# EasyEDA schematic SCH_espweather_2025-04-03.json
TITLE: espweather; REV: 1.0; Date: 2024-01-15; Sheet: 1/1; Drawn By: gitaroktato; Company: gitaroktato
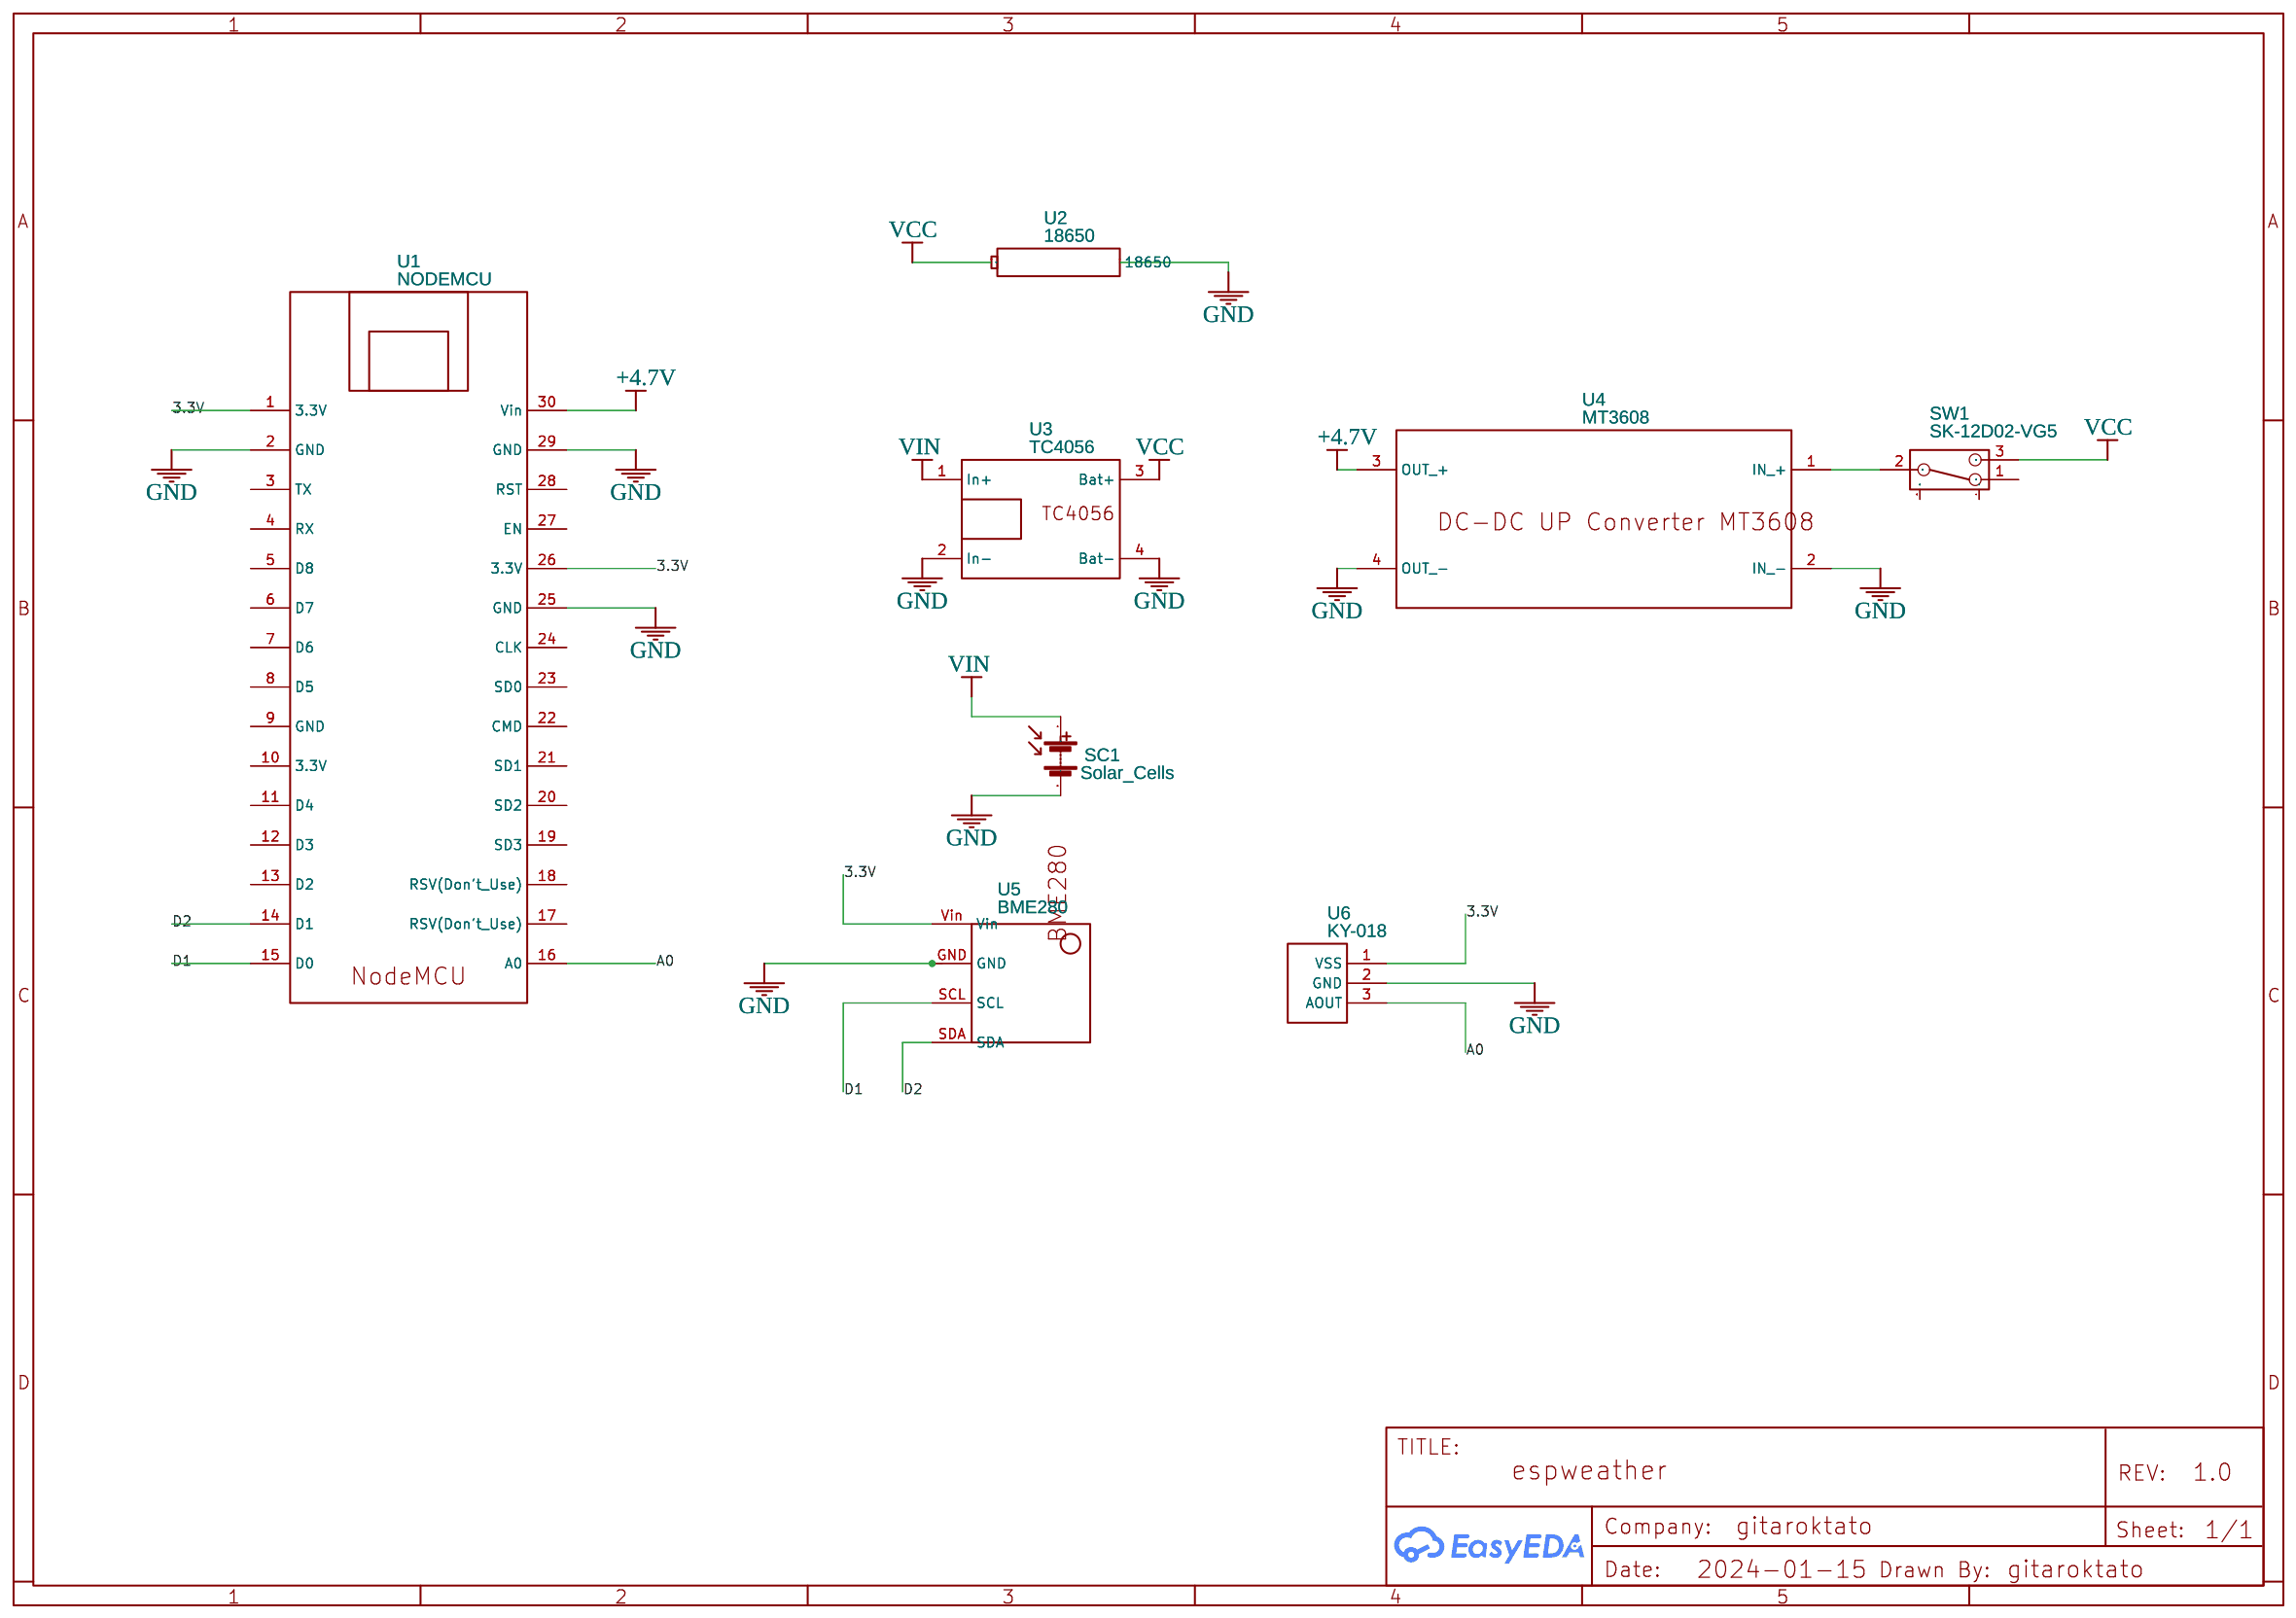
[diagram p0: schematic sheet]

## Parts
SC1  Solar_Cells
SW1  SK-12D02-VG5  [SW-TH_SK-12D02VG3]
U1  NODEMCU  [ESP12E_DEVKIT-V1]
U2  18650
U3  TC4056  [BATTERY CHARGER COPY]
U4  MT3608  [MT3608-ROUND Z]
U5  BME280  [BME280]
U6  KY-018

## Library data of the parts
SC1 = Solar_Cells: Contributor: KiCAD; license: https://www.gnu.org/licenses/lgpl-2.1.html
SW1 = SK-12D02-VG5: Supplier: LCSC; Supplier Part: C136722; Manufacturer: Rectangular Connectors - Contacts; Contributor: LCSC
U1 = NODEMCU: Contributor: canda410; sourceId: OGtr1ZXUS
U2 = 18650_2: catid: 20; Contributor: ashysb2115; sim: true
U3 = LIPO CHARGER FC-75 PCCN: Manufacturer Part: Lipo Charger FC-75; Contributor: paiboonp
U4 = MT3608: Contributor: beloborodov.arty
U5 = BME280 COPY: Contributor: Carlosjz
U6 = KY-018 Arduino Module: link: https://tkkrlab.nl/wiki/Arduino_KY-018_Photo_resistor_module; Contributor: everspy

## Nets
3.3V: U1.1(3.3V) U1.26(3.3V) U5.Vin U6.1(VSS)
+4.7V: U1.30(Vin) U4.3(OUT +)
GND: SC1.2(-) U1.2(GND) U1.25(GND) U1.29(GND) U2.1(18650) U3.2(In-) U3.4(Bat-) U4.2(IN -) U4.4(OUT -) U5.GND U6.2(GND)
VCC: SW1.3 U2.2 U3.3(Bat+)
VIN: SC1.1(+) U3.1(In+)
A0: U1.16(A0) U6.3(AOUT)
D1: U1.15(D0) U5.SCL
D2: U1.14(D1) U5.SDA
Net-(SW1-2): SW1.2 U4.1(IN +)

Not connected (* = marked no-connect by the designer): SW1 1 4 5; U1 3(TX) 4(RX) 5(D8) 6(D7) 7(D6) 8(D5) 9(GND) 10(3.3V) 11(D4) 12(D3) 13(D2) 17(RSV(Don't Use)) 18(RSV(Don't Use)) 19(SD3) 20(SD2) 21(SD1) 22(CMD) 23(SD0) 24(CLK) 27(EN) 28(RST)
